# Altium schematic sheet CarteAlimSch.SchDoc
size A4
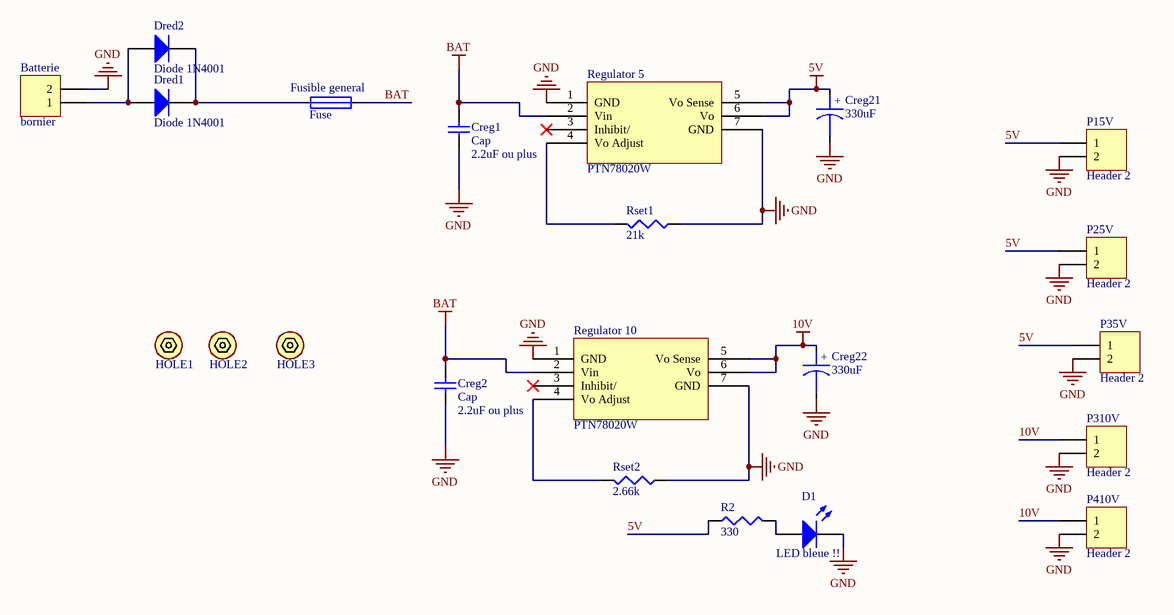
[diagram p0: CarteAlimSch.SchDoc]

## Parts
Batterie  bornier  [Bornier male coude 2 voies Gros]
Creg1  Cap  value 2.2uF ou plus  [RAD-0.3]
Creg2  Cap  value 2.2uF ou plus  [RAD-0.3]
Creg21  value 330uF  [RB.1/.3]  (hidden comment: CAP Pol)
Creg22  value 330uF  [RB.1/.3]  (hidden comment: CAP Pol)
D1  LED bleue !!  [LED 5mm red (dip)]
Dred1  Diode 1N4001  [DO-41]
Dred2  Diode 1N4001  [DO-41]
Fusible_general  Fuse  [Fuse Holder 5x20mm]
HOLE1  Hole  [SCREW]  (value not drawn)
HOLE2  Hole  [SCREW]  (value not drawn)
HOLE3  Hole  [SCREW]  (value not drawn)
P15V  Header 2  [Bornier male coude 2 voies]
P25V  Header 2  [Bornier male coude 2 voies]
P35V  Header 2  [Bornier male coude 2 voies]
P310V  Header 2  [Bornier male coude 2 voies]
P410V  Header 2  [Bornier male coude 2 voies]
R2  value 330  [AXIAL0.8]  (hidden comment: RES)
Regulator_5  PTN78020W  [PTN78020W]
Regulator_10  PTN78020W  [PTN78020W]
Rset1  value 21k  [AXIAL0.8]  (hidden comment: RES)
Rset2  value 2.66k  [AXIAL0.8]  (hidden comment: RES)

## Nets
5V: Creg21.1 P15V.1 P25V.1 P35V.1 R2.1 Regulator_5.5(Vo_Sense) Regulator_5.6(Vo)
10V: Creg22.1 P310V.1 P410V.1 Regulator_10.5(Vo_Sense) Regulator_10.6(Vo)
BAT: Creg1.2 Creg2.2 Fusible_general.2 Regulator_5.2(Vin) Regulator_10.2(Vin)
GND: Batterie.2 Creg1.1 Creg2.1 Creg21.2 Creg22.2 D1.K P15V.2 P25V.2 P35V.2 P310V.2 P410V.2 Regulator_5.1(GND) Regulator_5.7(GND) Regulator_10.1(GND) Regulator_10.7(GND) Rset1.1 Rset2.1
NetBatterie_1: Batterie.1 Dred1.1(A) Dred2.1(A)
NetD1_A: D1.A R2.2
NetDred1_2: Dred1.2(K) Dred2.2(K) Fusible_general.1
NetRegulator_5_4: Regulator_5.4(Vo_Adjust) Rset1.2
NetRegulator_10_4: Regulator_10.4(Vo_Adjust) Rset2.2

Not connected (* = marked no-connect by the designer): HOLE1 1(Hole); HOLE2 1(Hole); HOLE3 1(Hole); Regulator_5 3(Inhibit/)*; Regulator_10 3(Inhibit/)*

## Notes on the sheet
- (in symbol CAP Pol) +

## Library data of the parts
Batterie P15V P25V P35V P310V P410V = Header 2: Header, 2-Pin; LatestRevisionDate: 17-Jul-2002; LatestRevisionNote: Re-released for DXP Platform.; Publisher: Altium Limited
Creg1 Creg2 = Cap: Capacitor; Published: 8-Jun-2000; LatestRevisionDate: 17-Jul-2002; LatestRevisionNote: Re-released for DXP Platform.; PackageReference: RAD-0.3; Publisher: Altium Limited; PackageDescription: Radial Cap, Thru-Hole; 2 Leads; 0.3 in Pin Spacing
Creg21 Creg22 = CAP Pol: Polarized Capacitor
D1 = LED: Typical LED; Published: 8-Jun-2000; LatestRevisionDate: 17-Jul-2002; LatestRevisionNote: Re-released for DXP Platform.; PackageVersion: Feb-2002; PackageReference: 3.2X1.6X1.1; Publisher: Altium Limited; PackageDescription: SM LED; 2 Flat Leads
Dred1 Dred2 = Diode 1N4001: 1 Amp General Purpose Rectifier; Published: 8-Jun-2000; LatestRevisionDate: 17-Jul-2002; LatestRevisionNote: Re-released for DXP Platform.; DatasheetVersion: 1998; PackageVersion: Aug-1999; PackageReference: DO-41; Publisher: Altium Limited; PackageDescription: Diode, Axial; Body 5.2 x 2.7 mm (LxDia. max), Lead Dia. 0.86 mm (max); Code_JEDEC: DO-204-AL; ComponentLink1Description: Manufacturer Link; ComponentLink1URL: http://www.fairchildsemi.com/; ComponentLink2Description: Datasheet; ComponentLink2URL: http://www.fairchildsemi.com/ds/1N%2F1N4001.pdf
HOLE1-HOLE3 = Hole: Mounting Hole for screws
R2 Rset1 Rset2 = RES: Resistor; Published: 8-Jun-2000; LatestRevisionDate: 29-May-2009; LatestRevisionNote: IPC-7351 Footprint Added.; PackageReference: J1-0603; Publisher: Altium Limited; PackageDescription: Chip Resistor